# EasyEDA schematic Controller.json
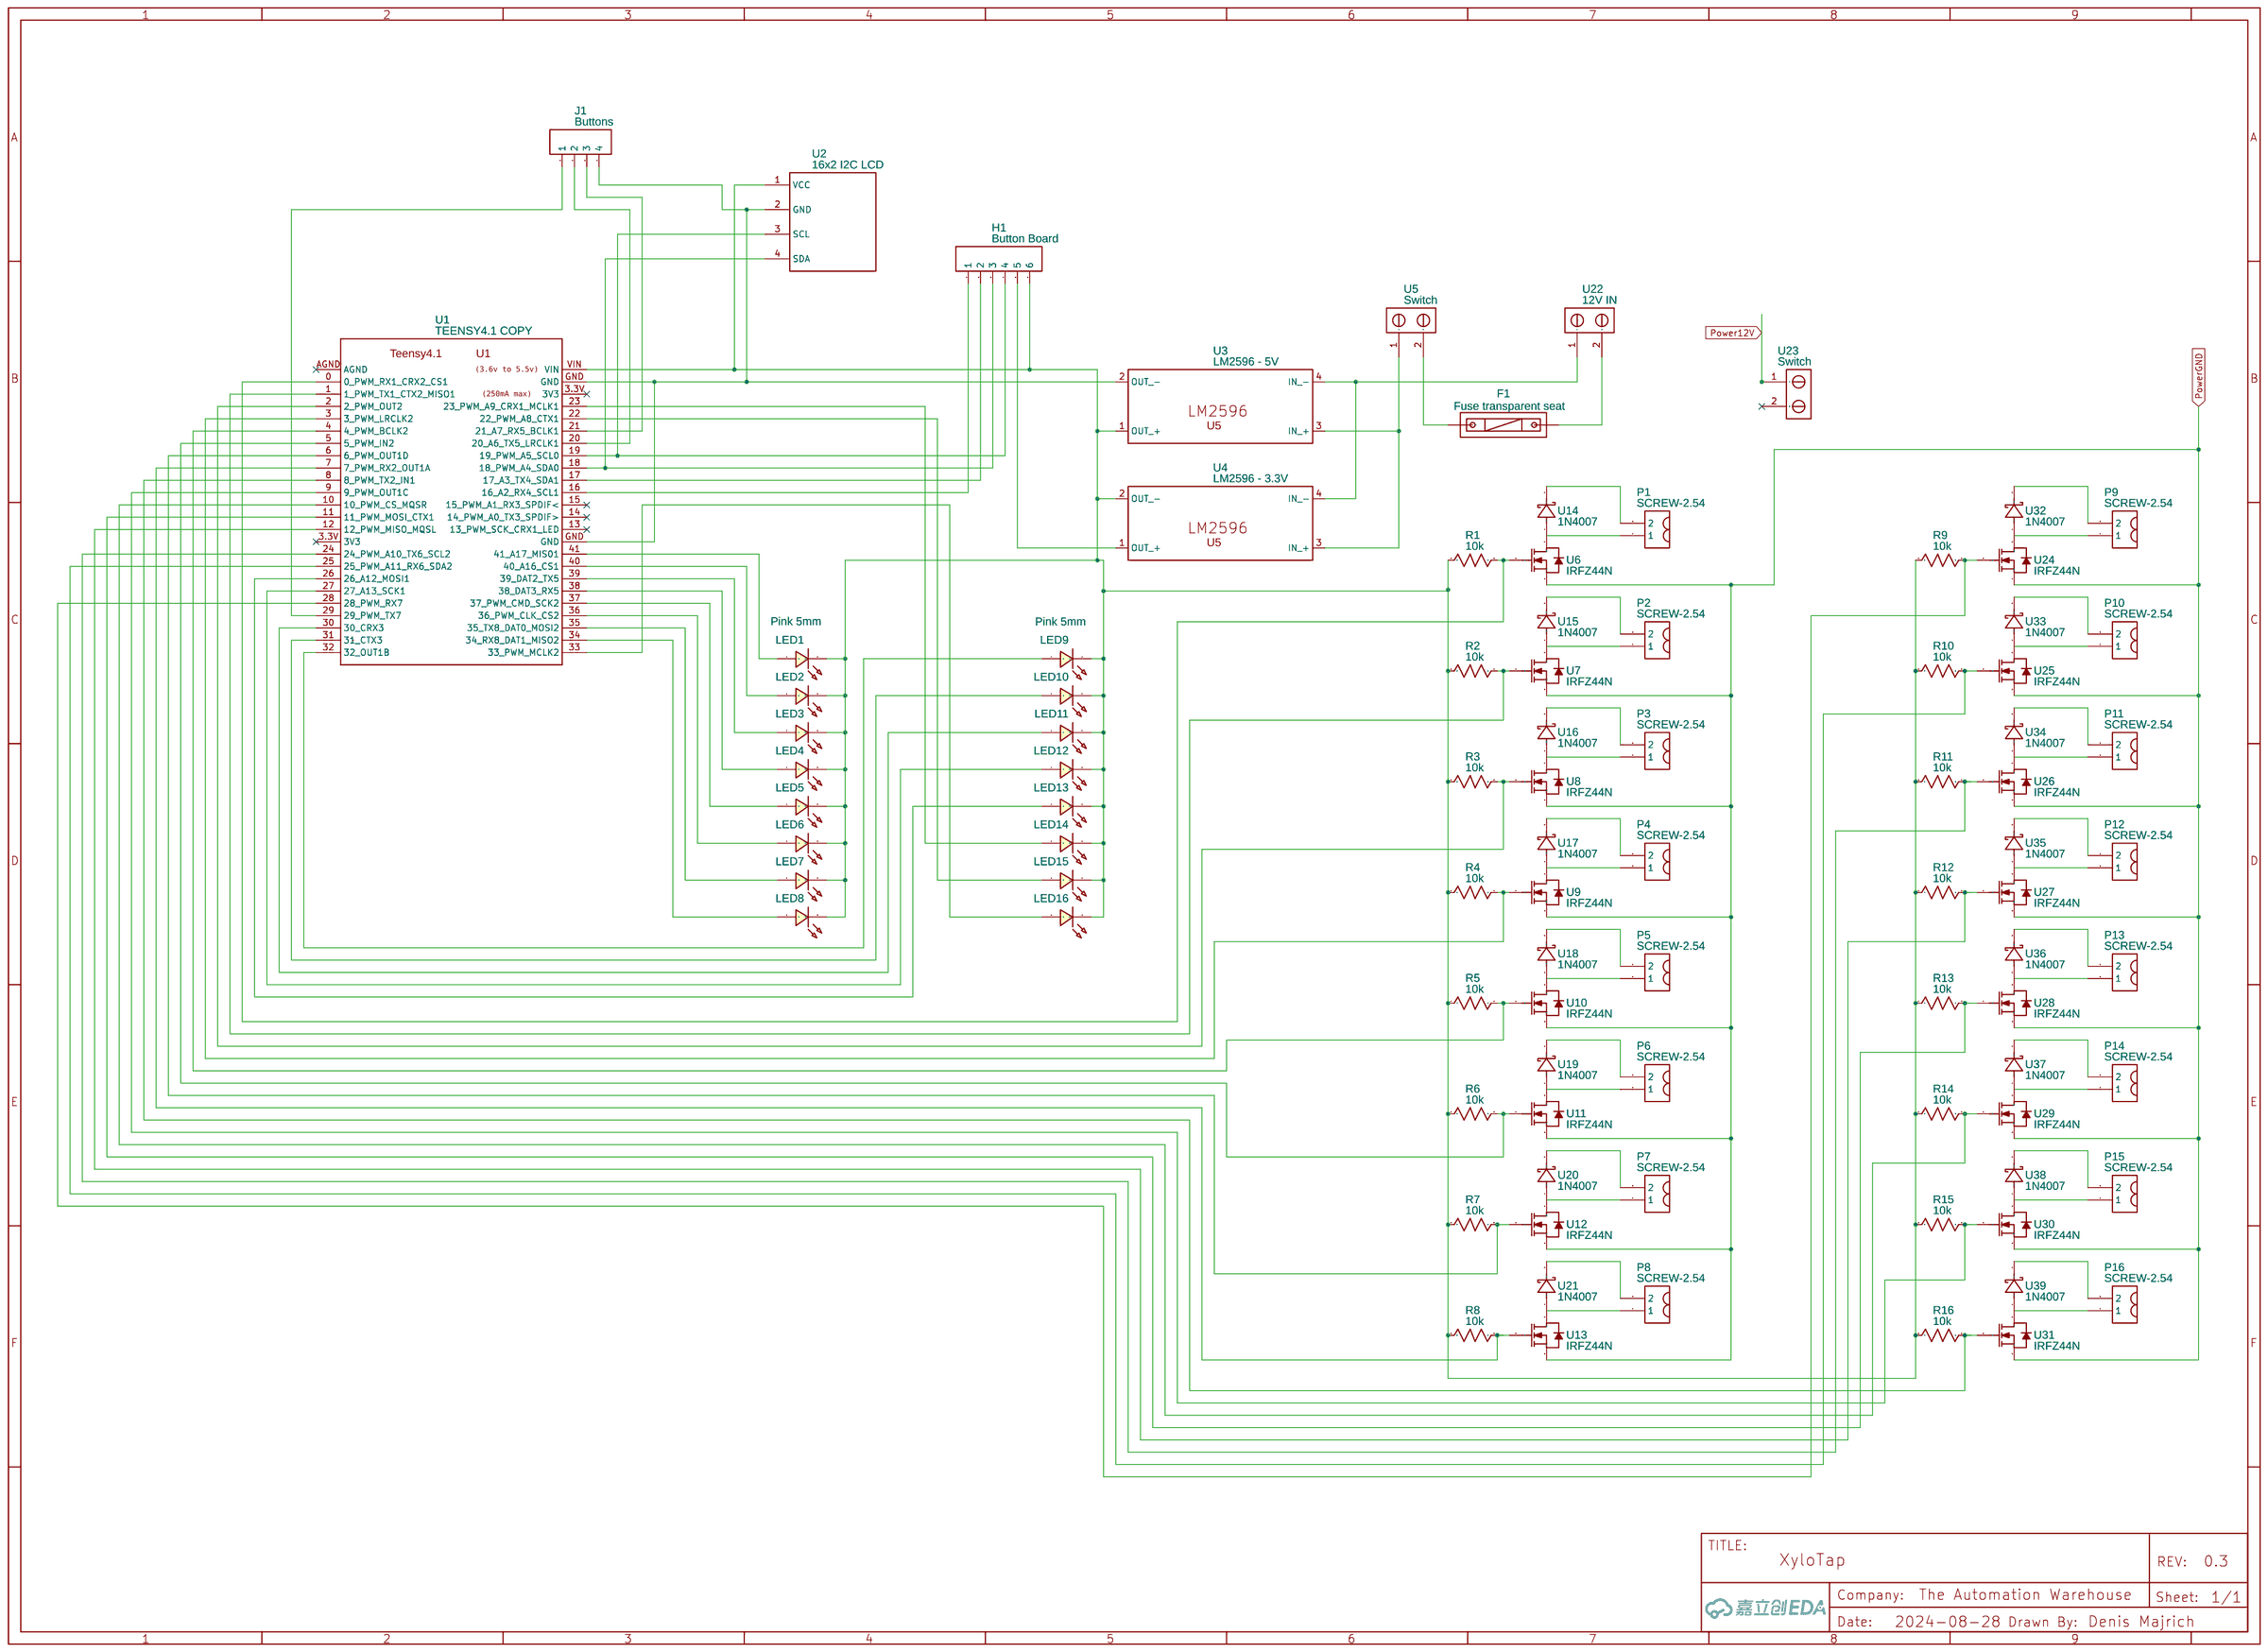
[diagram p0: schematic sheet]

## Parts
F1  Fuse transparent seat  [FUSE-TH_L24.5-W9.8-P22.5]
H1  Button Board  [HDR-F-2.54_1X6]
J1  Buttons  [HDR-M-2.54_1X4]
LED1  Pink 5mm  [LED-TH_BD5.0_BLUE]
LED2  Pink 5mm  [LED-TH_BD5.0_BLUE]
LED3  Pink 5mm  [LED-TH_BD5.0_BLUE]
LED4  Pink 5mm  [LED-TH_BD5.0_BLUE]
LED5  Pink 5mm  [LED-TH_BD5.0_BLUE]
LED6  Pink 5mm  [LED-TH_BD5.0_BLUE]
LED7  Pink 5mm  [LED-TH_BD5.0_BLUE]
LED8  Pink 5mm  [LED-TH_BD5.0_BLUE]
LED9  Pink 5mm  [LED-TH_BD5.0_BLUE]
LED10  Pink 5mm  [LED-TH_BD5.0_BLUE]
LED11  Pink 5mm  [LED-TH_BD5.0_BLUE]
LED12  Pink 5mm  [LED-TH_BD5.0_BLUE]
LED13  Pink 5mm  [LED-TH_BD5.0_BLUE]
LED14  Pink 5mm  [LED-TH_BD5.0_BLUE]
LED15  Pink 5mm  [LED-TH_BD5.0_BLUE]
LED16  Pink 5mm  [LED-TH_BD5.0_BLUE]
P1  SCREW-2.54  [PCBSCREW-2.54-2P]
P2  SCREW-2.54  [PCBSCREW-2.54-2P]
P3  SCREW-2.54  [PCBSCREW-2.54-2P]
P4  SCREW-2.54  [PCBSCREW-2.54-2P]
P5  SCREW-2.54  [PCBSCREW-2.54-2P]
P6  SCREW-2.54  [PCBSCREW-2.54-2P]
P7  SCREW-2.54  [PCBSCREW-2.54-2P]
P8  SCREW-2.54  [PCBSCREW-2.54-2P]
P9  SCREW-2.54  [PCBSCREW-2.54-2P]
P10  SCREW-2.54  [PCBSCREW-2.54-2P]
P11  SCREW-2.54  [PCBSCREW-2.54-2P]
P12  SCREW-2.54  [PCBSCREW-2.54-2P]
P13  SCREW-2.54  [PCBSCREW-2.54-2P]
P14  SCREW-2.54  [PCBSCREW-2.54-2P]
P15  SCREW-2.54  [PCBSCREW-2.54-2P]
P16  SCREW-2.54  [PCBSCREW-2.54-2P]
R1  10k  [R_AXIAL-0.4]
R2  10k  [R_AXIAL-0.4]
R3  10k  [R_AXIAL-0.4]
R4  10k  [R_AXIAL-0.4]
R5  10k  [R_AXIAL-0.4]
R6  10k  [R_AXIAL-0.4]
R7  10k  [R_AXIAL-0.4]
R8  10k  [R_AXIAL-0.4]
R9  10k  [R_AXIAL-0.4]
R10  10k  [R_AXIAL-0.4]
R11  10k  [R_AXIAL-0.4]
R12  10k  [R_AXIAL-0.4]
R13  10k  [R_AXIAL-0.4]
R14  10k  [R_AXIAL-0.4]
R15  10k  [R_AXIAL-0.4]
R16  10k  [R_AXIAL-0.4]
U1  TEENSY4.1 COPY  [TEENSY4.1]
U2  16x2 I2C LCD  [I2CLCD16X2 NO MOUNT]
U3  LM2596 - 5V  [LM2596ALEX]
U4  LM2596 - 3.3V  [LM2596ALEX]
U5  Switch  [TERMINAL_X2_5MM]
U6  IRFZ44N  [TO-220-3_L9.9-W4.5-P2.54-L]
U7  IRFZ44N  [TO-220-3_L9.9-W4.5-P2.54-L]
U8  IRFZ44N  [TO-220-3_L9.9-W4.5-P2.54-L]
U9  IRFZ44N  [TO-220-3_L9.9-W4.5-P2.54-L]
U10  IRFZ44N  [TO-220-3_L9.9-W4.5-P2.54-L]
U11  IRFZ44N  [TO-220-3_L9.9-W4.5-P2.54-L]
U12  IRFZ44N  [TO-220-3_L9.9-W4.5-P2.54-L]
U13  IRFZ44N  [TO-220-3_L9.9-W4.5-P2.54-L]
U14  1N4007  [DO-41_BD2.4-L4.7-P8.70-D0.8-FD]
U15  1N4007  [DO-41_BD2.4-L4.7-P8.70-D0.8-FD]
U16  1N4007  [DO-41_BD2.4-L4.7-P8.70-D0.8-FD]
U17  1N4007  [DO-41_BD2.4-L4.7-P8.70-D0.8-FD]
U18  1N4007  [DO-41_BD2.4-L4.7-P8.70-D0.8-FD]
U19  1N4007  [DO-41_BD2.4-L4.7-P8.70-D0.8-FD]
U20  1N4007  [DO-41_BD2.4-L4.7-P8.70-D0.8-FD]
U21  1N4007  [DO-41_BD2.4-L4.7-P8.70-D0.8-FD]
U22  12V IN  [TERMINAL_X2_5MM]
U23  Switch  [TERMINAL_X2_5MM]
U24  IRFZ44N  [TO-220-3_L9.9-W4.5-P2.54-L]
U25  IRFZ44N  [TO-220-3_L9.9-W4.5-P2.54-L]
U26  IRFZ44N  [TO-220-3_L9.9-W4.5-P2.54-L]
U27  IRFZ44N  [TO-220-3_L9.9-W4.5-P2.54-L]
U28  IRFZ44N  [TO-220-3_L9.9-W4.5-P2.54-L]
U29  IRFZ44N  [TO-220-3_L9.9-W4.5-P2.54-L]
U30  IRFZ44N  [TO-220-3_L9.9-W4.5-P2.54-L]
U31  IRFZ44N  [TO-220-3_L9.9-W4.5-P2.54-L]
U32  1N4007  [DO-41_BD2.4-L4.7-P8.70-D0.8-FD]
U33  1N4007  [DO-41_BD2.4-L4.7-P8.70-D0.8-FD]
U34  1N4007  [DO-41_BD2.4-L4.7-P8.70-D0.8-FD]
U35  1N4007  [DO-41_BD2.4-L4.7-P8.70-D0.8-FD]
U36  1N4007  [DO-41_BD2.4-L4.7-P8.70-D0.8-FD]
U37  1N4007  [DO-41_BD2.4-L4.7-P8.70-D0.8-FD]
U38  1N4007  [DO-41_BD2.4-L4.7-P8.70-D0.8-FD]
U39  1N4007  [DO-41_BD2.4-L4.7-P8.70-D0.8-FD]

## Library data of the parts
F1 = Fuse transparent seat: Supplier: LCSC; Manufacturer: xcfuse(旭程); Supplier Part: C58066; JLCPCB Part Class: Extended Part
H1 = HDR-F-2.54_1x6: Supplier Part: C40877; Supplier: LCSC; Contributor: LCEDA_Lib
J1 = HDR-M-2.54_1x4: Supplier Part: C124378; Supplier: LCSC; Contributor: LCEDA_Lib
LED1-LED16 = LED-TH-5mm_B: Supplier: LCSC; Contributor: LCEDA_Lib
P1-P16 = PCBSCREW-2.54-2P: Contributor: marceloncosta
R1-R16 = R_AXIAL-0.4_US: Contributor: LCEDA_Lib
U1 = TEENSY4.1 COPY: Manufacturer: PJRC; Manufacturer Part: Teensy4.1; link: https://www.pjrc.com/store/teensy41.html; Contributor: laserline2000
U2 = 16x2 i2c LCD no mount on PCB: Contributor: edgm
U3 U4 = LM2596ALEX: Contributor: Pegasik76
U5 U22 U23 = Terminal_x2_5mm: Contributor: ianpcrawford
U6-U13 U24-U31 = IRFZ44N: Contributor: lcsc; Supplier: LCSC; Supplier Part: C7429904; Manufacturer: minos(迈诺斯); JLCPCB Part Class: Extended Part
U14-U21 U32-U39 = 1N4007-DIODE: Contributor: LCSC; Supplier: LCSC; Supplier Part: C9900005663; Manufacturer: null

## Nets
Power12V: U23.1
PowerGND: U6.3(S) U7.3(S) U8.3(S) U9.3(S) U10.3(S) U11.3(S) U12.3(S) U13.3(S) U24.3(S) U25.3(S) U26.3(S) U27.3(S) U28.3(S) U29.3(S) U30.3(S) U31.3(S)
Net-(F1-1): F1.1 U22.2
Net-(F1-2): F1.2 U5.2
Net-(H1-1): H1.1 U1.16(16_A2_RX4_SCL1)
Net-(H1-2): H1.2 U1.17(17_A3_TX4_SDA1)
Net-(H1-3): H1.3 U1.18(18_PWM_A4_SDA0) U2.4(SDA)
Net-(H1-4): H1.4 U1.19(19_PWM_A5_SCL0) U2.3(SCL)
Net-(H1-5): H1.5 U4.1(OUT +)
Net-(H1-6): H1.6 LED1.2 LED2.2 LED3.2 LED4.2 LED5.2 LED6.2 LED7.2 LED8.2 LED9.2 LED10.2 LED11.2 LED12.2 LED13.2 LED14.2 LED15.2 LED16.2 R1.1 R2.1 R3.1 R4.1 R5.1 R6.1 R7.1 R8.1 R9.1 R10.1 R11.1 R12.1 R13.1 R14.1 R15.1 R16.1 U1.VIN U2.1(VCC) U3.1(OUT +) U4.2(OUT -)
Net-(J1-1): J1.1 U1.29(29_PWM_TX7)
Net-(J1-2): J1.2 U1.20(20_A6_TX5_LRCLK1)
Net-(J1-3): J1.3 U1.21(21_A7_RX5_BCLK1)
Net-(J1-4): J1.4 U1.GND U2.2(GND) U3.2(OUT -)
Net-(LED1-1): LED1.1 U1.41(41_A17_MIS01)
Net-(LED2-1): LED2.1 U1.40(40_A16_CS1)
Net-(LED3-1): LED3.1 U1.39(39_DAT2_TX5)
Net-(LED4-1): LED4.1 U1.38(38_DAT3_RX5)
Net-(LED5-1): LED5.1 U1.37(37_PWM_CMD_SCK2)
Net-(LED6-1): LED6.1 U1.36(36_PWM_CLK_CS2)
Net-(LED7-1): LED7.1 U1.35(35_TX8_DAT0_MOSI2)
Net-(LED8-1): LED8.1 U1.34(34_RX8_DAT1_MISO2)
Net-(LED9-1): LED9.1 U1.32(32_OUT1B)
Net-(LED10-1): LED10.1 U1.31(31_CTX3)
Net-(LED11-1): LED11.1 U1.30(30_CRX3)
Net-(LED12-1): LED12.1 U1.27(27_A13_SCK1)
Net-(LED13-1): LED13.1 U1.26(26_A12_MOSI1)
Net-(LED14-1): LED14.1 U1.23(23_PWM_A9_CRX1_MCLK1)
Net-(LED15-1): LED15.1 U1.22(22_PWM_A8_CTX1)
Net-(LED16-1): LED16.1 U1.33(33_PWM_MCLK2)
Net-(P1-1): P1.1 U6.2(D) U14.1(A)
Net-(P1-2): P1.2 U14.2(K)
Net-(P2-1): P2.1 U7.2(D) U15.1(A)
Net-(P2-2): P2.2 U15.2(K)
Net-(P3-1): P3.1 U8.2(D) U16.1(A)
Net-(P3-2): P3.2 U16.2(K)
Net-(P4-1): P4.1 U9.2(D) U17.1(A)
Net-(P4-2): P4.2 U17.2(K)
Net-(P5-1): P5.1 U10.2(D) U18.1(A)
Net-(P5-2): P5.2 U18.2(K)
Net-(P6-1): P6.1 U11.2(D) U19.1(A)
Net-(P6-2): P6.2 U19.2(K)
Net-(P7-1): P7.1 U12.2(D) U20.1(A)
Net-(P7-2): P7.2 U20.2(K)
Net-(P8-1): P8.1 U13.2(D) U21.1(A)
Net-(P8-2): P8.2 U21.2(K)
Net-(P9-1): P9.1 U24.2(D) U32.1(A)
Net-(P9-2): P9.2 U32.2(K)
Net-(P10-1): P10.1 U25.2(D) U33.1(A)
Net-(P10-2): P10.2 U33.2(K)
Net-(P11-1): P11.1 U26.2(D) U34.1(A)
Net-(P11-2): P11.2 U34.2(K)
Net-(P12-1): P12.1 U27.2(D) U35.1(A)
Net-(P12-2): P12.2 U35.2(K)
Net-(P13-1): P13.1 U28.2(D) U36.1(A)
Net-(P13-2): P13.2 U36.2(K)
Net-(P14-1): P14.1 U29.2(D) U37.1(A)
Net-(P14-2): P14.2 U37.2(K)
Net-(P15-1): P15.1 U30.2(D) U38.1(A)
Net-(P15-2): P15.2 U38.2(K)
Net-(P16-1): P16.1 U31.2(D) U39.1(A)
Net-(P16-2): P16.2 U39.2(K)
Net-(R1-2): R1.2 U1.0(0_PWM_RX1_CRX2_CS1) U6.1(G)
Net-(R2-2): R2.2 U1.1(1_PWM_TX1_CTX2_MISO1) U7.1(G)
Net-(R3-2): R3.2 U1.2(2_PWM_OUT2) U8.1(G)
Net-(R4-2): R4.2 U1.3(3_PWM_LRCLK2) U9.1(G)
Net-(R5-2): R5.2 U1.4(4_PWM_BCLK2) U10.1(G)
Net-(R6-2): R6.2 U1.5(5_PWM_IN2) U11.1(G)
Net-(R7-2): R7.2 U1.6(6_PWM_OUT1D) U12.1(G)
Net-(R8-2): R8.2 U1.7(7_PWM_RX2_OUT1A) U13.1(G)
Net-(R9-2): R9.2 U1.28(28_PWM_RX7) U24.1(G)
Net-(R10-2): R10.2 U1.25(25_PWM_A11_RX6_SDA2) U25.1(G)
Net-(R11-2): R11.2 U1.24(24_PWM_A10_TX6_SCL2) U26.1(G)
Net-(R12-2): R12.2 U1.12(12_PWM_MISO_MQSL) U27.1(G)
Net-(R13-2): R13.2 U1.11(11_PWM_MOSI_CTX1) U28.1(G)
Net-(R14-2): R14.2 U1.10(10_PWM_CS_MQSR) U29.1(G)
Net-(R15-2): R15.2 U1.9(9_PWM_OUT1C) U30.1(G)
Net-(R16-2): R16.2 U1.8(8_PWM_TX2_IN1) U31.1(G)
Net-(U3-3): U3.3(IN +) U4.3(IN +) U5.1
Net-(U3-4): U3.4(IN -) U4.4(IN -) U22.1

Not connected (* = marked no-connect by the designer): U1 3.3V(3V3)* 13(13_PWM_SCK_CRX1_LED)* 14(14_PWM_A0_TX3_SPDIF>)* 15(15_PWM_A1_RX3_SPDIF<)* AGND*; U23 2*
